# Altium project car-radar.PrjPcb
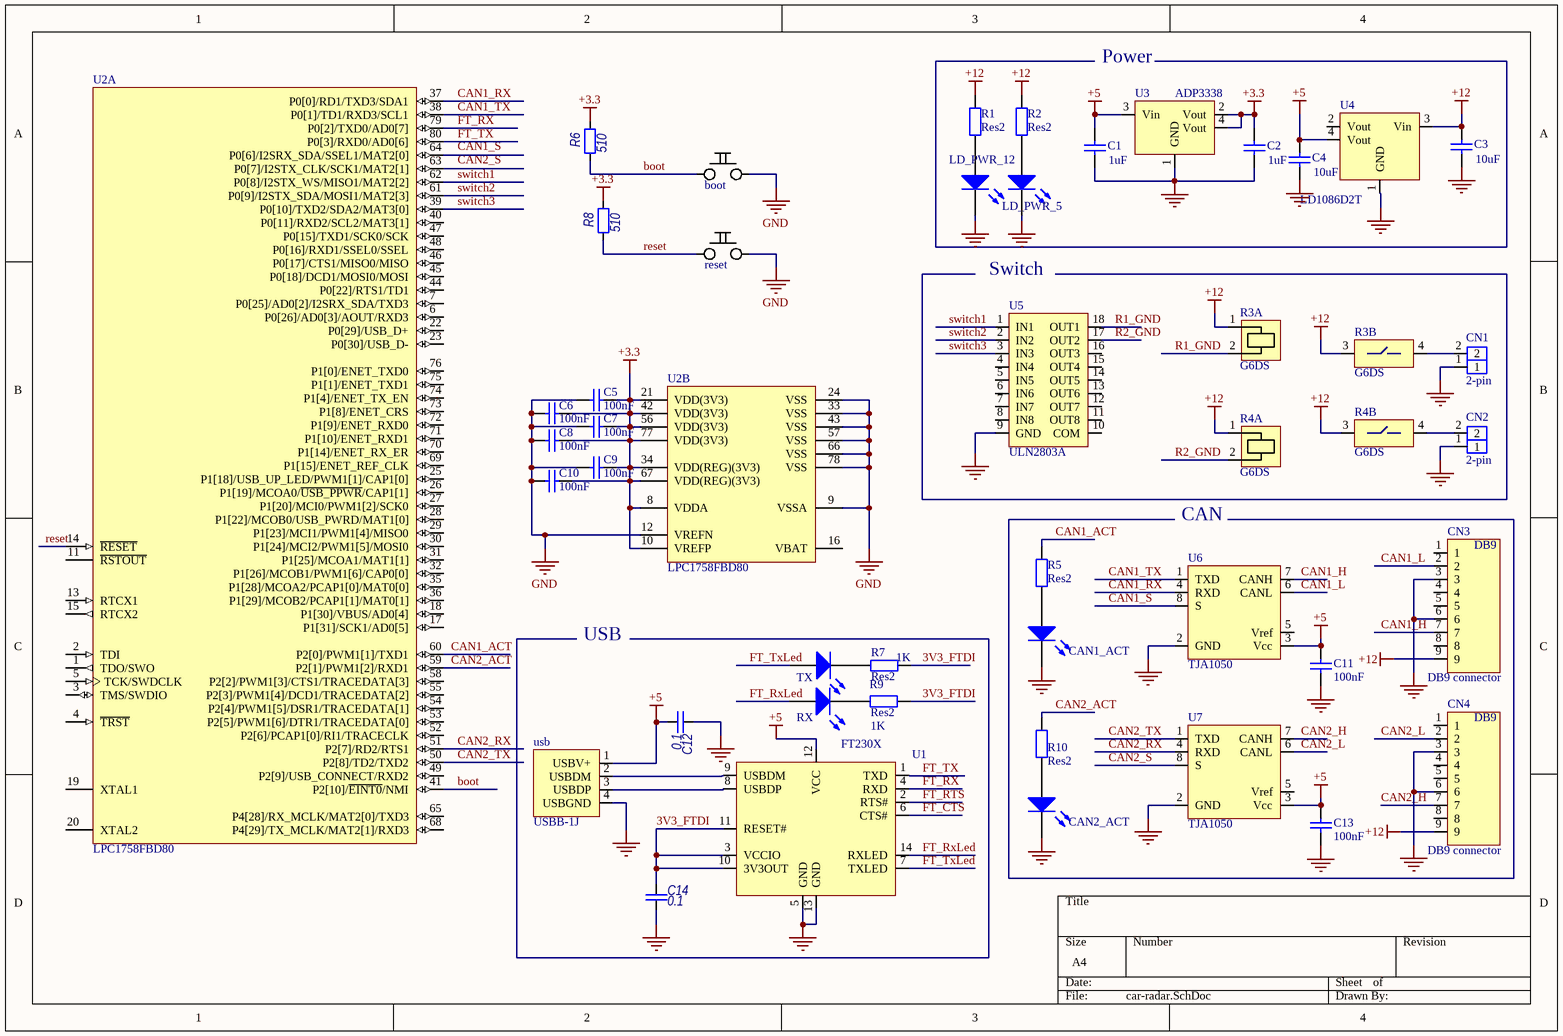
[diagram p0: car-radar.SchDoc]
1 sheet, 44 parts. Net scope: global (net labels, ports and power ports of the same name join across sheets).

## Sheet car-radar.SchDoc
size A4

### Parts
boot  chip button  [BUTTON SMD]  (value not drawn)
C1  value 1uF  [CAPC1608M]  (hidden comment: Cap)
C2  value 1uF  [CAPC1608M]  (hidden comment: Cap)
C3  value 10uF  [CAPC1608N]  (hidden comment: Cap)
C4  value 10uF  [CAPC1608N]  (hidden comment: Cap)
C5  value 100nF  [CAPC1608N]  (hidden comment: p)
C6  value 100nF  [CAPC1608N]  (hidden comment: p)
C7  value 100nF  [CAPC1608N]  (hidden comment: p)
C8  value 100nF  [CAPC1608N]  (hidden comment: p)
C9  value 100nF  [CAPC1608N]  (hidden comment: p)
C10  value 100nF  [CAPC1608N]  (hidden comment: p)
C11  value 100nF  [CAPC1608N]  (hidden comment: p)
C12  0.1  [CAPC1608M]
C13  value 100nF  [CAPC1608N]  (hidden comment: p)
C14  0.1  [Cap_0805]
CAN1_ACT  led  [RESC1608M]  (value not drawn)
CAN2_ACT  led  [RESC1608M]  (value not drawn)
CN1  2-pin
CN2  2-pin
CN3  DB9 connector  [DSUB1.385-2H9C]
CN4  DB9 connector  [DSUB1.385-2H9C]
LD_PWR_5  led  [RESC1608M]  (value not drawn)
LD_PWR_12  led  [RESC1608M]  (value not drawn)
R1  Res2  [RESC3216M]
R2  Res2  [RESC3216M]
R3  G6DS  (parts A,B of 2)
R4  G6DS  (parts A,B of 2)
R5  Res2  [RESC3216M]
R6  510  [RESC2012M]
R7  Res2  value 1K  [RESC3216M]
R8  510  [RESC2012M]
R9  Res2  value 1K  [RESC3216M]
R10  Res2  [RESC3216M]
reset  chip button  [BUTTON SMD]  (value not drawn)
RX  led  [RESC2012M]  (value not drawn)
TX  led  [RESC2012M]  (value not drawn)
U1  FT230X  [SOP635P600-16N]
U2  LPC1758FBD80  [SOT315-1_V]  (parts A,B of 2)
U3  ADP3338  [SOT223-4M]
U4  LD1086D2T  [TO228P960-3_4M]
U5  ULN2803A  [SOIC127P1030-18L]
U6  TJA1050
U7  TJA1050
usb  USBB-1J  [USB2.5-2V4]

### Nets
+3.3: C2.1 C5.2 C6.2 C7.2 C8.2 C9.2 C10.2 R6.2 R8.2 U2.8(VDDA) U2.10(VREFP) U2.21(VDD(3V3)) U2.34(VDD(REG)(3V3)) U2.42(VDD(3V3)) U2.56(VDD(3V3)) U2.67(VDD(REG)(3V3)) U2.77(VDD(3V3)) U3.2(Vout) U3.4(Vout)
+5: C1.1 C4.1 C11.2 C12.2 C13.2 U1.12(VCC) U3.3(Vin) U4.4(Vout) U6.3(Vcc) U7.3(Vcc) usb.1(USBV+)
+12: C3.1 CN3.9 CN4.9 R1.2 R2.2 R3.1 R3.3 R4.1 R4.3 U4.3(Vin)
GND: boot.2 C1.2 C2.2 C3.2 C4.2 C5.1 C6.1 C7.1 C8.1 C9.1 C10.1 C11.1 C12.1 C13.1 C14.2 CAN1_ACT.2(K) CAN2_ACT.2(K) CN1.1 CN2.1 CN3.3 CN3.6 CN4.3 CN4.6 LD_PWR_5.2(K) LD_PWR_12.2(K) reset.2 U1.5(GND) U1.13(GND) U2.9(VSSA) U2.12(VREFN) U2.24(VSS) U2.33(VSS) U2.43(VSS) U2.57(VSS) U2.66(VSS) U2.78(VSS) U3.1(GND) U4.1(GND) U5.9(GND) U6.2(GND) U7.2(GND) usb.4(USBGND)
3V3_FTDI: C14.1 R7.1 R9.1 U1.3(VCCIO) U1.10(3V3OUT) U1.11(RESET#)
boot: boot.1 R6.1 U2.41(P2[10]/~{EINT0}/NMI)
CAN1_ACT: R5.2 U2.60(P2[0]/PWM1[1]/TXD1)
CAN1_H: CN3.7 U6.7(CANH)
CAN1_L: CN3.2 U6.6(CANL)
CAN1_RX: U2.37(P0[0]/RD1/TXD3/SDA1) U6.4(RXD)
CAN1_S: U6.8(S)
CAN1_TX: U2.38(P0[1]/TD1/RXD3/SCL1) U6.1(TXD)
CAN2_ACT: R10.2 U2.59(P2[1]/PWM1[2]/RXD1)
CAN2_H: CN4.7 U7.7(CANH)
CAN2_L: CN4.2 U7.6(CANL)
CAN2_RX: U2.51(P2[7]/RD2/RTS1) U7.4(RXD)
CAN2_S: U7.8(S)
CAN2_TX: U2.50(P2[8]/TD2/TXD2) U7.1(TXD)
FT_CTS: U1.6(CTS#)
FT_RTS: U1.2(RTS#)
FT_RX: U1.4(RXD) U2.79(P0[2]/TXD0/AD0[7])
FT_RxLed: RX.1(A) U1.14(RXLED)
FT_TX: U1.1(TXD) U2.80(P0[3]/RXD0/AD0[6])
FT_TxLed: TX.1(A) U1.7(TXLED)
R1_GND: R3.2 U5.18(OUT1)
R2_GND: R4.2 U5.17(OUT2)
reset: R8.1 reset.1 U2.14(~{RESET})
switch1: U2.62(P0[8]/I2STX_WS/MISO1/MAT2[2]) U5.1(IN1)
switch2: U2.61(P0[9]/I2STX_SDA/MOSI1/MAT2[3]) U5.2(IN2)
switch3: U2.39(P0[10]/TXD2/SDA2/MAT3[0]) U5.3(IN3)
NetCAN1_ACT_1: CAN1_ACT.1(A) R5.1
NetCAN2_ACT_1: CAN2_ACT.1(A) R10.1
NetCN1_2: CN1.2 R3.4
NetCN2_2: CN2.2 R4.4
NetLD_PWR_5_1: LD_PWR_5.1(A) R2.1
NetLD_PWR_12_1: LD_PWR_12.1(A) R1.1
NetR7_2: R7.2 TX.2(K)
NetR9_2: R9.2 RX.2(K)
NetU1_8: U1.8(USBDP) usb.3(USBDP)
NetU1_9: U1.9(USBDM) usb.2(USBDM)

Not connected (* = marked no-connect by the designer): CN3 1 4 5 8; CN4 1 4 5 8; U1 15(CBUS0) 16(CBUS3); U2 1(TDO/SWO) 2(TDI) 3(TMS/SWDIO) 4(~{TRST}) 5(TCK/SWDCLK) 6(P0[26]/AD0[3]/AOUT/RXD3) 7(P0[25]/AD0[2]/I2SRX_SDA/TXD3) 11(~{RSTOUT}) 13(RTCX1) 15(RTCX2) 16(VBAT) 17(P1[31]/SCK1/AD0[5]) 18(P1[30]/VBUS/AD0[4]) 19(XTAL1) 20(XTAL2) 22(P0[29]/USB_D+) 23(P0[30]/USB_D-) 25(P1[18]/USB_UP_LED/PWM1[1]/CAP1[0]) 26(P1[19]/MCOA0/~{USB_PPWR}/CAP1[1]) 27(P1[20]/MCI0/PWM1[2]/SCK0) 28(P1[22]/MCOB0/USB_PWRD/MAT1[0]) 29(P1[23]/MCI1/PWM1[4]/MISO0) 30(P1[24]/MCI2/PWM1[5]/MOSI0) 31(P1[25]/MCOA1/MAT1[1]) 32(P1[26]/MCOB1/PWM1[6]/CAP0[0]) 35(P1[28]/MCOA2/PCAP1[0]/MAT0[0]) 36(P1[29]/MCOB2/PCAP1[1]/MAT0[1]) 40(P0[11]/RXD2/SCL2/MAT3[1]) 44(P0[22]/RTS1/TD1) 45(P0[18]/DCD1/MOSI0/MOSI) 46(P0[17]/CTS1/MISO0/MISO) 47(P0[15]/TXD1/SCK0/SCK) 48(P0[16]/RXD1/SSEL0/SSEL) 49(P2[9]/USB_CONNECT/RXD2) 52(P2[6]/PCAP1[0]/RI1/TRACECLK) 53(P2[5]/PWM1[6]/DTR1/TRACEDATA[0]) 54(P2[4]/PWM1[5]/DSR1/TRACEDATA[1]) 55(P2[3]/PWM1[4]/DCD1/TRACEDATA[2]) 58(P2[2]/PWM1[3]/CTS1/TRACEDATA[3]) 63(P0[7]/I2STX_CLK/SCK1/MAT2[1]) 64(P0[6]/I2SRX_SDA/SSEL1/MAT2[0]) 65(P4[28]/RX_MCLK/MAT2[0]/TXD3) 68(P4[29]/TX_MCLK/MAT2[1]/RXD3) 69(P1[15]/ENET_REF_CLK) 70(P1[14]/ENET_RX_ER) 71(P1[10]/ENET_RXD1) 72(P1[9]/ENET_RXD0) 73(P1[8]/ENET_CRS) 74(P1[4]/ENET_TX_EN) 75(P1[1]/ENET_TXD1) 76(P1[0]/ENET_TXD0); U4 2(Vout); U5 4(IN4) 5(IN5) 6(IN6) 7(IN7) 8(IN8) 10(COM) 11(OUT8) 12(OUT7) 13(OUT6) 14(OUT5) 15(OUT4) 16(OUT3); U6 5(Vref); U7 5(Vref)

### Notes on the sheet
- Power
- Switch
- CAN
- USB
- Labels drawn without touching a wire or pin: CAN1_S, CAN2_S
- (in symbol DB9 разъём) DB9

### Library data of the parts
C1-C11 C13 = Cap: Capacitor; Published: 8-Jun-2000; LatestRevisionDate: 17-Jul-2002; LatestRevisionNote: Re-released for DXP Platform.; PackageReference: RAD-0.3; Publisher: Altium Limited; PackageDescription: Radial Cap, Thru-Hole; 2 Leads; 0.3 in Pin Spacing
C12 C14 = Cap: Ceramic capacitors; ValueBOM: *; MarkPCB: *; ValueSCH: 0.1
CAN1_ACT CAN2_ACT LD_PWR_5 LD_PWR_12 RX TX = chip led
CN3 CN4 = DB9 разъём
R1 R2 R5 R10 = Res2: Resistor; Value: 1K; Published: 8-Jun-2000; LatestRevisionDate: 17-Jul-2002; LatestRevisionNote: Re-released for DXP Platform.; PackageReference: AXIAL-0.4; Publisher: Altium Limited; PackageDescription: Axial Device, Thru-Hole; 2 Leads; 0.4 in Pin Spacing
R3 R4 = rele-SPST-NO: SPST-NO rele
R6 R8 = Res: Ceramic resisors; ValueBOM: *; MarkPCB: *; ValueSCH: 510
R7 R9 = Res2: Resistor; Published: 8-Jun-2000; LatestRevisionDate: 17-Jul-2002; LatestRevisionNote: Re-released for DXP Platform.; PackageReference: AXIAL-0.4; Publisher: Altium Limited; PackageDescription: Axial Device, Thru-Hole; 2 Leads; 0.4 in Pin Spacing
U2 = LPC1758FBD80: 32-bit ARM Cortex-M3 MCU, 512 kB Flash, 64 kB SRAM, 100 MHz, USB 2.0 Device/Host/OTG, Ethernet, CAN, 12-Bit ADC, DAC, I2S, 80-Pin LQFP; fmax: 100 MHz; SRAM: 64 kB; Flash: 512 kB; GPIOs: 52; USB: 1; CAN: 2; UART: 4; PWM: 6; PLL: Y; VDD (min): 2.4 V; VDD (typ): 3.3 V; VDD (max): 3.6 V; Code_IEC: 136E15; DatasheetVersion: Rev. 7, Mar-2011; PackageVersion: Feb-2003; PackageReference: SOT315-1; PackageDescription: LQFP80: Plastic Low Profile Quad Flat Package; 80 Leads; Body 12 x 12 x 1.4 mm; SPI: 1; SSP: 2; ADC channels: 6; Timers: 4; Code_JEDEC: MS-026; PartNumber: LPC1758FBD80; ComponentLink1Description: Manufacturer URL; ComponentLink1URL: http://www.nxp.com/; ComponentLink2Description: Datasheet; ComponentLink2URL: http://www.nxp.com/documents/data_sheet/LPC1759_58_56_54_52_51.pdf
U3 = ADP3339: ADP3339AKCZ-3.3-R7
U4 = LD1086D2T: st LD1086D2T
U5 = ULN2803A: EIGHT DARLINGTON ARRAYS
U6 U7 = TJA1050: High speed CAN transceiver
usb = USBB-1J: url: http://www.brownbear.ru/components/usbb-1j.html